# Altium schematic sheet MCU_32.SchDoc: MCU
size A4; DocumentNumber: MB1180; Revision: C.1; SheetNumber: 2; SheetTotal: 3; Project: NUCLEO32
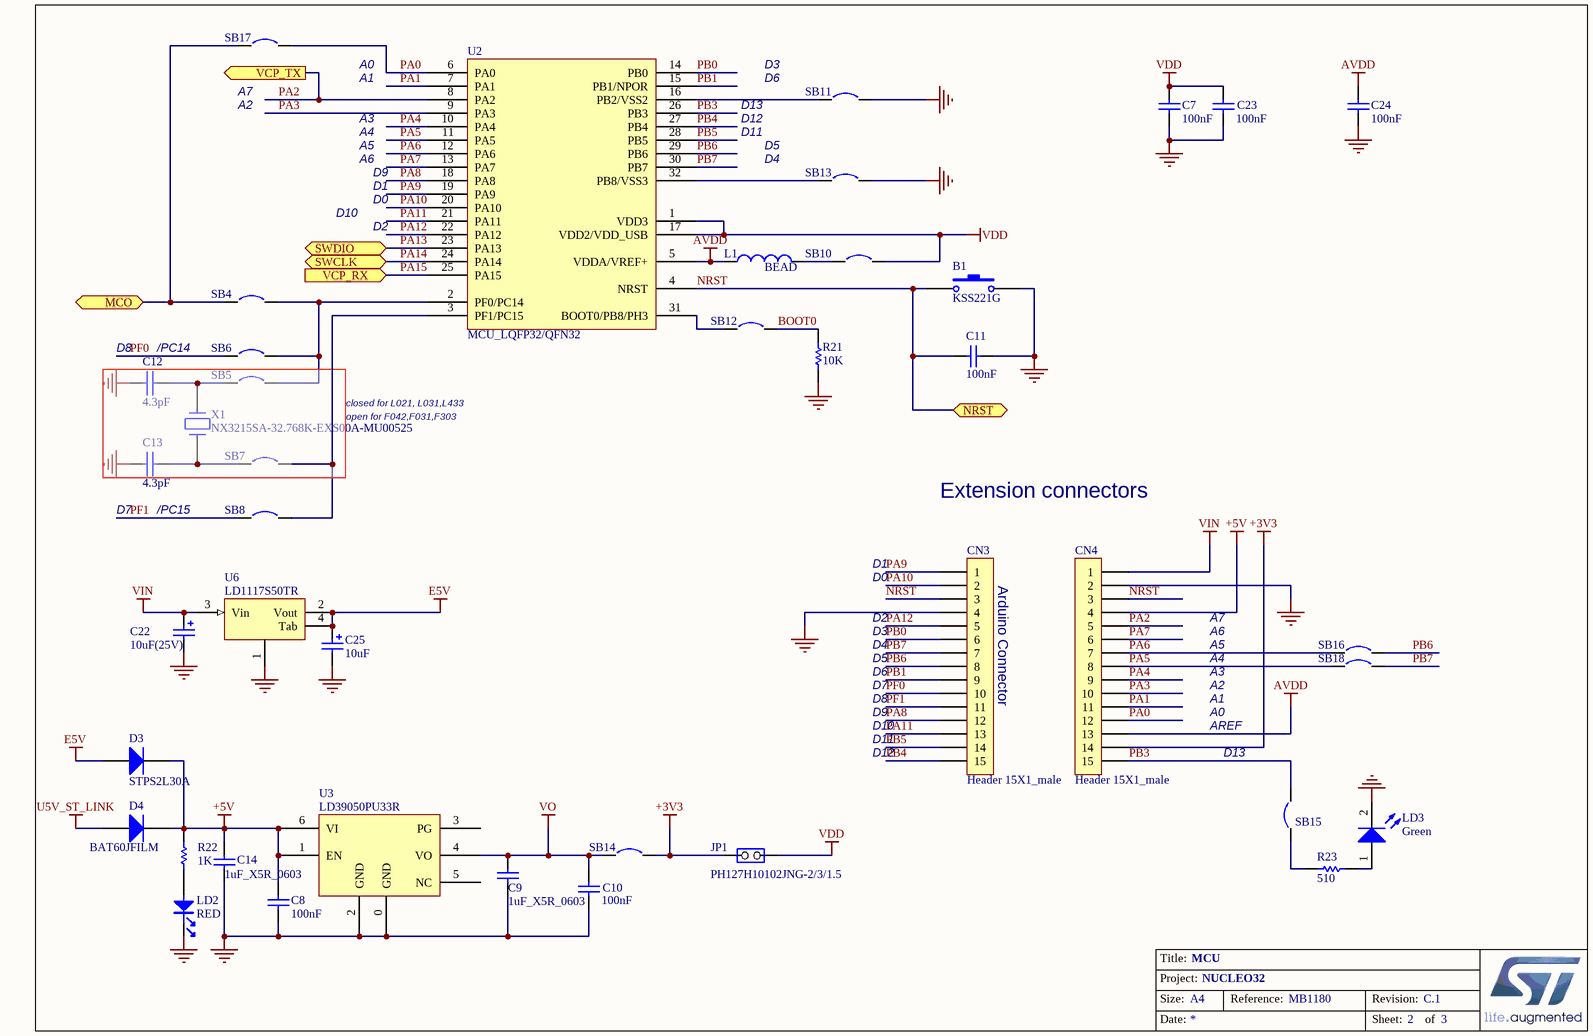
[diagram p0: MCU_32.SchDoc]

## Parts
B1  KSS221G  [SW2_5R6_5R5x3R1]
C7  100nF  [0603C]
C8  100nF  [0603C]
C9  1uF_X5R_0603  [0603C]
C10  100nF  [0603C]
C11  100nF  [0603C]
C12  4.3pF  [0603C]
C13  4.3pF  [0603C]
C14  1uF_X5R_0603  [0603C]
C22  10uF(25V)  [TAN_B]
C23  100nF  [0603C]
C24  100nF  [0603C]
C25  10uF  [TAN_A]
CN3  Header 15X1_male  [HDR_1x15_2R54_V_F]
CN4  Header 15X1_male  [HDR_1x15_2R54_V_F]
D3  STPS2L30A  [SMA]
D4  BAT60JFILM  [SOD-323]
JP1  PH127H10102JNG-2/3/1.5  [HDR_1x2_1R27_R_M]
L1  BEAD  [0603L]
LD2  RED  [0603D_R]
LD3  Green  [0603D_G]
R21  10K  [0603R]
R22  1K  [0603R]
R23  510  [0603R]
SB4  Circuit Breaker (open)  [SB_0603]  (value not drawn)
SB5  Circuit Breaker  [SB_0603]  (value not drawn)
SB6  Circuit Breaker  [SB_0603]  (value not drawn)
SB7  Circuit Breaker  [SB_0603]  (value not drawn)
SB8  Circuit Breaker  [SB_0603]  (value not drawn)
SB10  Circuit Breaker (close)  [SB_0603]  (value not drawn)
SB11  Circuit Breaker (close)  [SB_0603]  (value not drawn)
SB12  Circuit Breaker (close)  [SB_0603]  (value not drawn)
SB13  Circuit Breaker (close)  [SB_0603]  (value not drawn)
SB14  Circuit Breaker (close)  [SB_0603]  (value not drawn)
SB15  Circuit Breaker (close)  [SB_0603]  (value not drawn)
SB16  Circuit Breaker (close)  [SB_0603]  (value not drawn)
SB17  Circuit Breaker (open)  [SB_0603]  (value not drawn)
SB18  Circuit Breaker (close)  [SB_0603]  (value not drawn)
U2  MCU_LQFP32/QFN32  [LQFP32_0R5_7x7]
U3  LD39050PU33R  [DFN6_0R95_3x3_TP]
U6  LD1117S50TR  [SOT-223]
X1  NX3215SA-32.768K-EXS00A-MU00525  [XTAL_2SM_3R2X1R5]

## Ports
MCO, NRST, SWCLK, SWDIO, VCP_RX (in), VCP_TX (out)

## Nets
+3V3: CN4.14 JP1.1(COMMON) SB14.2
+5V: C8.2 C14.1 CN4.4 D3.2(K) D4.2(K) R22.2 U3.1(EN) U3.6(VI)
AVDD: C24.1 CN4.13 L1.1 U2.5(VDDA/VREF+)
E5V: C25.1 D3.1(A) U6.2(Vout) U6.4(Tab)
GND: B1.2 C7.2 C8.1 C9.2 C10.1 C11.1 C12.2 C13.2 C14.2 C22.2 C23.2 C24.2 C25.2 CN3.4 CN4.2 LD2.2 LD3.2(K) R21.2 SB11.2 SB13.2 U3.0(GND) U3.2(GND) U6.1
U5V_ST_LINK: D4.1(A)
VDD: C7.1 C23.1 JP1.2(NO) SB10.2 U2.1(VDD3) U2.17(VDD2/VDD_USB)
VIN: C22.1 CN4.1 U6.3(Vin)
VO: C9.1 C10.2 SB14.1 U3.4(VO)
BOOT0: R21.1 SB12.2
MCO: SB4.1 SB17.1 ; port MCO
NRST: B1.1 C11.2 CN3.3 CN4.3 U2.4(NRST) ; port NRST
PA0: CN4.12 SB17.2 U2.6(PA0)
PA1: CN4.11 U2.7(PA1)
PA2: CN4.5 U2.8(PA2) ; port VCP_TX
PA3: CN4.10 U2.9(PA3)
PA4: CN4.9 U2.10(PA4)
PA5: CN4.8 SB18.1 U2.11(PA5)
PA6: CN4.7 SB16.1 U2.12(PA6)
PA7: CN4.6 U2.13(PA7)
PA8: CN3.12 U2.18(PA8)
PA9: CN3.1 U2.19(PA9)
PA10: CN3.2 U2.20(PA10)
PA11: CN3.13 U2.21(PA11)
PA12: CN3.5 U2.22(PA12)
PA13: U2.23(PA13) ; port SWDIO
PA14: U2.24(PA14) ; port SWCLK
PA15: U2.25(PA15) ; port VCP_RX
PB0: CN3.6 U2.14(PB0)
PB1: CN3.9 U2.15(PB1/NPOR)
PB3: CN4.15 SB15.2 U2.26(PB3)
PB4: CN3.15 U2.27(PB4)
PB5: CN3.14 U2.28(PB5)
PB6: CN3.8 SB16.2 U2.29(PB6)
PB7: CN3.7 SB18.2 U2.30(PB7)
PF0: CN3.10 SB6.1
PF1: CN3.11 SB8.1
NetC12_1: C12.1 SB5.1 X1.1
NetC13_1: C13.1 SB7.1 X1.2
NetL1_2: L1.2 SB10.1
NetLD2_1: LD2.1 R22.1
NetLD3_1: LD3.1(A) R23.1
NetR23_2: R23.2 SB15.1
NetSB4_2: SB4.2 SB5.2 SB6.2 U2.2(PF0/PC14)
NetSB7_2: SB7.2 SB8.2 U2.3(PF1/PC15)
NetSB11_1: SB11.1 U2.16(PB2/VSS2)
NetSB12_1: SB12.1 U2.31(BOOT0/PB8/PH3)
NetSB13_1: SB13.1 U2.32(PB8/VSS3)

Not connected (* = marked no-connect by the designer): U3 3(PG) 5(NC)

## Notes on the sheet
- A2
- (near SB17) A7
- A0
- A1
- D3
- (near SB11) D13
- D6
- A3
- A5
- A6
- A4
- D9
- D4
- D11
- D12
- D5
- D10
- D0
- D1
- D2
- (near C12) D8
- (near C12) /PC14
- closed for L021, L031,L433
- open for F042,F031,F303
- (near C13) D7
- /PC15
- Extension connectors
- (near CN3) Arduino Connector
- A7
- D7
- D8
- AREF
- D13
- Title:
- Project:
- Size:
- Date:
- Reference:
- Sheet:
- Revision:
- of

## Library data of the parts
B1 = SW-PB: Switch; Published: 24-Mar-1999; LatestRevisionDate: 17-Jul-2002; LatestRevisionNote: Re-released for DXP Platform.; PackageReference: SPST-2; Publisher: Altium Limited
C7 C23 C24 = Cap: Capacitor; Value: 10nF; Published: 8-Jun-2000; Revision: July-2002: Re-released for DXP Platform.; Publisher: Altium Limited
C8 C10 = Capacitor_ST: Capacitor 0402 / 0603 / 0805; Revision: July-2002: Re-released for DXP Platform.; Value: 100nF
C9 C14 = CAP SMD 0603  X5R 1µF 25V 10%: 0603  X5R 1µF; Rated voltage: 25V; Tolerance: 10%; Manufacturer: *; Manufacturer P/N: *; Order code Farnell: 1288202RL; Value: 1µF; Power: *; Technology: X5R; Temperature  Factor: *; Temperature Max: +125°C; Temperature Min: -55°C; STS Code: *
C11 = CAP: Capacitor; Value: 100pF; Published: 8-Jun-2000; Revision: July-2002: Re-released for DXP Platform.; Publisher: Altium Limited
C12 C13 = CAP: Capacitor
C22 C25 = Cap Pol1: Polarized Capacitor (Radial); Published: 8-Jun-2000; Revision: July-2002: Re-released for DXP Platform.; Publisher: Altium Limited; Value: 10uF
CN3 CN4 = Header 15X1_Female_1: Header, 10-Pin, Single row,female; LatestRevisionDate: 17-Jul-2002; LatestRevisionNote: Re-released for DXP Platform.; Publisher: Altium Limited
D3 = STPS2L30A: Manuf_1: STM; Provided: ST; Order: BAT60JFILM; ECCN_US/EU: EAR99/NEC; Revision: July-2002: Re-released for DXP Platform.; Manuf_Part_1: BAT60JFILM; Distrib: ST
D4 = BAT60JFILM: Manuf_1: STM; Provided: ST; ECCN_US/EU: EAR99/NEC; Revision: July-2002: Re-released for DXP Platform.; Order: BAT60JFILM; Manuf_Part_1: BAT60JFILM; Distrib: ST
JP1 = JP2
L1 = Inductor: Value: 100uH; Published: 8-Jun-2000; Revision: July-2002: Re-released for DXP Platform.; Publisher: Altium Limited
LD2 = PHOTO
LD3 = LED2: Typical RED, GREEN, YELLOW, AMBER GaAs LED; Published: 8-Jun-2000; Revision: July-2002: Re-released for DXP Platform.; Publisher: Altium Limited
R21 = res1: Resistor; Value: 1K; Published: 8-Jun-2000; Revision: July-2002: Re-released for DXP Platform.; Publisher: Altium Limited
R22 = Resistor_ST: Resistor 0402 / 0603 / 0805; Description: Resistor 0402 or 0603 or 0805; Value: 10K
R23 = Res1: Resistor; Value: 1K; Published: 8-Jun-2000; Revision: July-2002: Re-released for DXP Platform.; Publisher: Altium Limited
SB4-SB8 SB10-SB18 = Circuit Breaker: Solder: NO; Published: 24-Mar-1999; Revision: July-2002: Re-released for DXP Platform.; Publisher: Altium Limited
U2 = MCU_LQFP32
U3 = LD39050P
U6 = LD1117
X1 = CRYSTAL_32K: Crystal